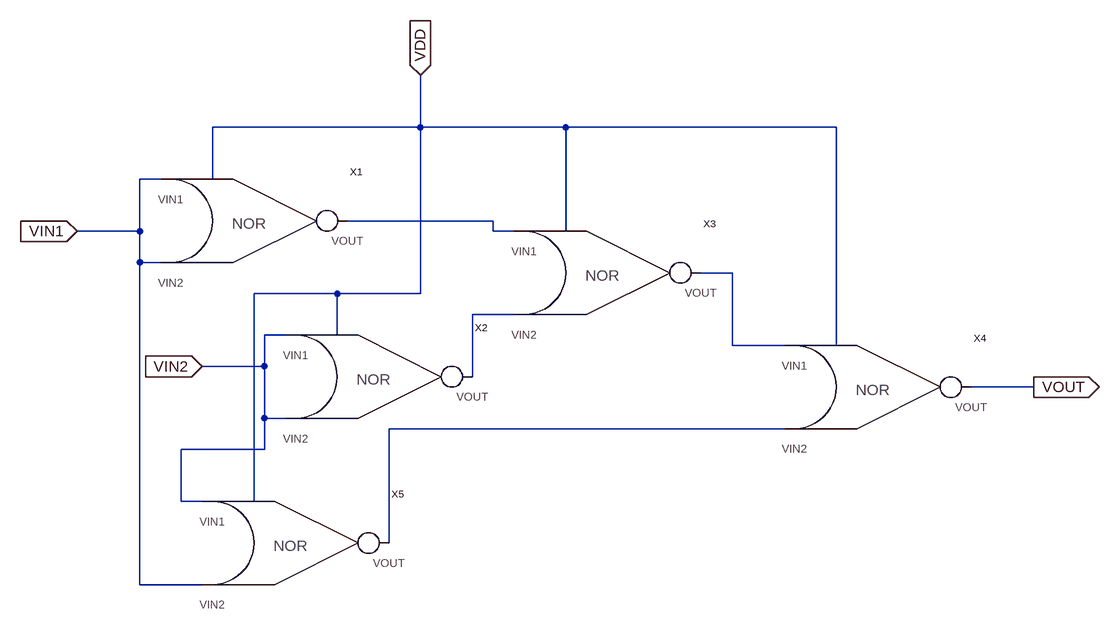
[diagram p0: schematic xor.asc]
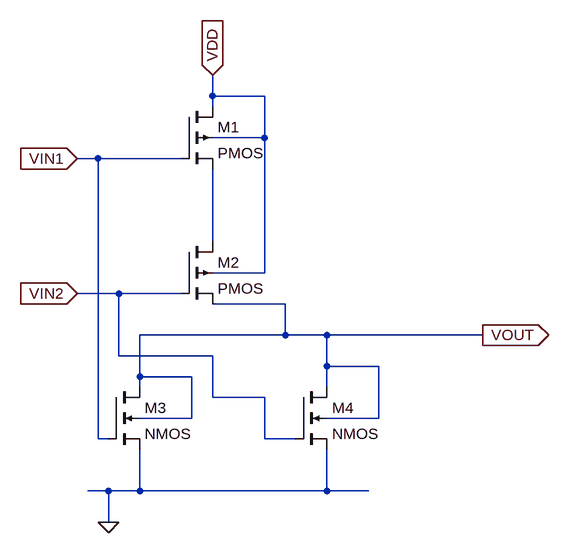
[diagram p1: sub-circuit nor.asc]
xor.asc, the LTspice schematic file:
Version 4
SHEET 1 1624 716
WIRE 592 -32 592 -112
WIRE 592 -32 272 -32
WIRE 816 -32 592 -32
WIRE 1232 -32 816 -32
WIRE 208 48 160 48
WIRE 272 48 272 -32
WIRE 704 112 480 112
WIRE 160 128 160 48
WIRE 160 128 64 128
WIRE 704 128 704 112
WIRE 752 128 704 128
WIRE 816 128 816 -32
WIRE 160 176 160 128
WIRE 208 176 160 176
WIRE 1072 192 1024 192
WIRE 464 224 336 224
WIRE 592 224 592 -32
WIRE 592 224 464 224
WIRE 752 256 672 256
WIRE 400 288 352 288
WIRE 464 288 464 224
WIRE 1072 304 1072 192
WIRE 1168 304 1072 304
WIRE 1232 304 1232 -32
WIRE 352 336 352 288
WIRE 352 336 256 336
WIRE 672 352 672 256
WIRE 1536 368 1440 368
WIRE 352 416 352 336
WIRE 400 416 352 416
WIRE 1168 432 544 432
WIRE 352 464 352 416
WIRE 352 464 224 464
WIRE 224 544 224 464
WIRE 272 544 224 544
WIRE 336 544 336 224
WIRE 544 608 544 432
WIRE 160 672 160 176
WIRE 272 672 160 672
FLAG 64 128 VIN1
IOPIN 64 128 In
FLAG 256 336 VIN2
IOPIN 256 336 In
FLAG 1536 368 VOUT
IOPIN 1536 368 Out
FLAG 592 -112 VDD
IOPIN 592 -112 In
SYMBOL nor 272 80 R0
SYMATTR InstName X1
SYMBOL nor 464 320 R0
SYMATTR InstName X2
SYMBOL nor 816 160 R0
SYMATTR InstName X3
SYMBOL nor 1232 336 R0
SYMATTR InstName X4
SYMBOL nor 336 576 R0
SYMATTR InstName X5

nor.asc, the sub-circuit schematic file:
Version 4
SHEET 1 880 680
WIRE -32 -48 -32 -80
WIRE 48 -48 -32 -48
WIRE -32 -32 -32 -48
WIRE 48 16 48 -48
WIRE 48 16 -32 16
WIRE -208 48 -240 48
WIRE -80 48 -208 48
WIRE -32 176 -32 64
WIRE 48 224 48 16
WIRE 48 224 -32 224
WIRE -176 256 -240 256
WIRE -80 256 -176 256
WIRE 80 272 -32 272
WIRE 80 320 80 272
WIRE 80 320 -144 320
WIRE 144 320 80 320
WIRE 384 320 144 320
WIRE -176 352 -176 256
WIRE -32 352 -176 352
WIRE 144 368 144 320
WIRE 224 368 144 368
WIRE -144 384 -144 320
WIRE -64 384 -144 384
WIRE -144 400 -144 384
WIRE 144 400 144 368
WIRE -32 416 -32 352
WIRE 48 416 -32 416
WIRE -64 448 -64 384
WIRE -64 448 -144 448
WIRE 224 448 224 368
WIRE 224 448 144 448
WIRE -208 480 -208 48
WIRE -192 480 -208 480
WIRE 48 480 48 416
WIRE 96 480 48 480
WIRE -192 560 -224 560
WIRE -144 560 -144 496
WIRE -144 560 -192 560
WIRE 144 560 144 496
WIRE 144 560 -144 560
WIRE 208 560 144 560
WIRE -192 608 -192 560
FLAG -32 -80 VDD
IOPIN -32 -80 In
FLAG -240 48 VIN1
IOPIN -240 48 In
FLAG -240 256 VIN2
IOPIN -240 256 In
FLAG 384 320 VOUT
IOPIN 384 320 Out
FLAG -192 608 0
SYMBOL pmos4 -80 -32 R0
SYMATTR InstName M1
SYMBOL pmos4 -80 176 R0
SYMATTR InstName M2
SYMBOL nmos4 -192 400 R0
SYMATTR InstName M3
SYMBOL nmos4 96 400 R0
SYMATTR InstName M4

The netlist it stands for:
* xor.asc
XX1 VIN1 VIN1 N001 VDD nor
XX2 VIN2 VIN2 N003 VDD nor
XX3 N001 N003 N002 VDD nor
XX4 N002 N004 VOUT VDD nor
XX5 VIN2 VIN1 N004 VDD nor

* block symbol definitions
.subckt nor VIN1 VIN2 VOUT VDD
M1 VDD VIN1 N001 VDD PMOS
M2 N001 VIN2 VOUT VDD PMOS
M3 VOUT VIN1 0 VOUT NMOS
M4 VOUT VIN2 0 VOUT NMOS
.ends nor

.model NMOS NMOS
.model PMOS PMOS
.lib standard.mos
.backanno
.end